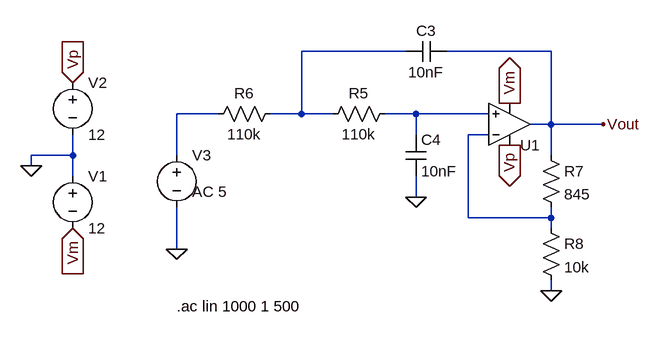
[diagram p0: schematic First-Order-Active-Low-Pass-Butterworth-Filter.asc]
First-Order-Active-Low-Pass-Butterworth-Filter.asc, the LTspice schematic file:
Version 4
SHEET 1 916 680
WIRE -144 32 -304 32
WIRE 80 32 -80 32
WIRE -432 128 -496 128
WIRE -304 128 -304 32
WIRE -304 128 -352 128
WIRE -256 128 -304 128
WIRE -128 128 -176 128
WIRE -16 128 -128 128
WIRE 80 144 80 32
WIRE 80 144 48 144
WIRE 160 144 80 144
WIRE -128 160 -128 128
WIRE -16 160 -48 160
WIRE -656 192 -656 160
WIRE -656 192 -720 192
WIRE -496 192 -496 128
WIRE 80 192 80 144
WIRE -720 208 -720 192
WIRE -656 224 -656 192
WIRE -128 256 -128 224
WIRE -48 288 -48 160
WIRE 80 288 80 272
WIRE 80 288 -48 288
WIRE 80 304 80 288
WIRE -496 336 -496 272
WIRE 80 400 80 384
FLAG 80 400 0
FLAG -128 256 0
FLAG -720 208 0
FLAG -656 80 Vp
IOPIN -656 80 In
FLAG -656 304 Vm
IOPIN -656 304 In
FLAG 16 176 Vp
IOPIN 16 176 Out
FLAG 16 112 Vm
IOPIN 16 112 Out
FLAG -496 336 0
FLAG 160 144 Vout
SYMBOL OpAmps\\UniversalOpAmp 16 144 M180
SYMATTR InstName U1
SYMBOL cap -80 16 R90
WINDOW 0 0 32 VBottom 2
WINDOW 3 32 32 VTop 2
SYMATTR InstName C3
SYMATTR Value 10nF
SYMBOL res -160 112 R90
WINDOW 0 0 56 VBottom 2
WINDOW 3 32 56 VTop 2
SYMATTR InstName R5
SYMATTR Value 110k
SYMBOL res 64 176 R0
SYMATTR InstName R7
SYMATTR Value 845
SYMBOL res 64 288 R0
SYMATTR InstName R8
SYMATTR Value 10k
SYMBOL cap -144 160 R0
SYMATTR InstName C4
SYMATTR Value 10nF
SYMBOL res -336 112 R90
WINDOW 0 0 56 VBottom 2
WINDOW 3 32 56 VTop 2
SYMATTR InstName R6
SYMATTR Value 110k
SYMBOL voltage -656 208 R0
WINDOW 123 0 0 Left 0
WINDOW 39 0 0 Left 0
SYMATTR InstName V1
SYMATTR Value 12
SYMBOL voltage -656 64 R0
WINDOW 123 0 0 Left 0
WINDOW 39 0 0 Left 0
SYMATTR InstName V2
SYMATTR Value 12
SYMBOL voltage -496 176 R0
WINDOW 3 24 44 Left 2
WINDOW 123 24 72 Left 2
WINDOW 39 0 0 Left 0
SYMATTR InstName V3
SYMATTR Value ""
SYMATTR Value2 AC 5
TEXT -496 424 Left 2 !.ac lin 1000 1 500

The netlist it stands for:
* First-Order-Active-Low-Pass-Butterworth-Filter.asc
XU1 N003 N004 Vp Vm Vout level1 Avol=1Meg GBW=10Meg Vos=0 En=0 Enk=0 In=0 Ink=0 Rin=500Meg  ; pins In+ In- V+ V- OUT
C3 Vout N001 10nF
R5 N003 N001 110k
R7 Vout N004 845
R8 N004 0 10k
C4 N003 0 10nF
R6 N001 N002 110k
V1 0 Vm 12
V2 Vp 0 12
V3 N002 0 AC 5
.ac lin 1000 1 500
.lib UniversalOpAmp1.lib
.backanno
.end